# EAGLE design 5411507 (EAGLE 6.6.0)
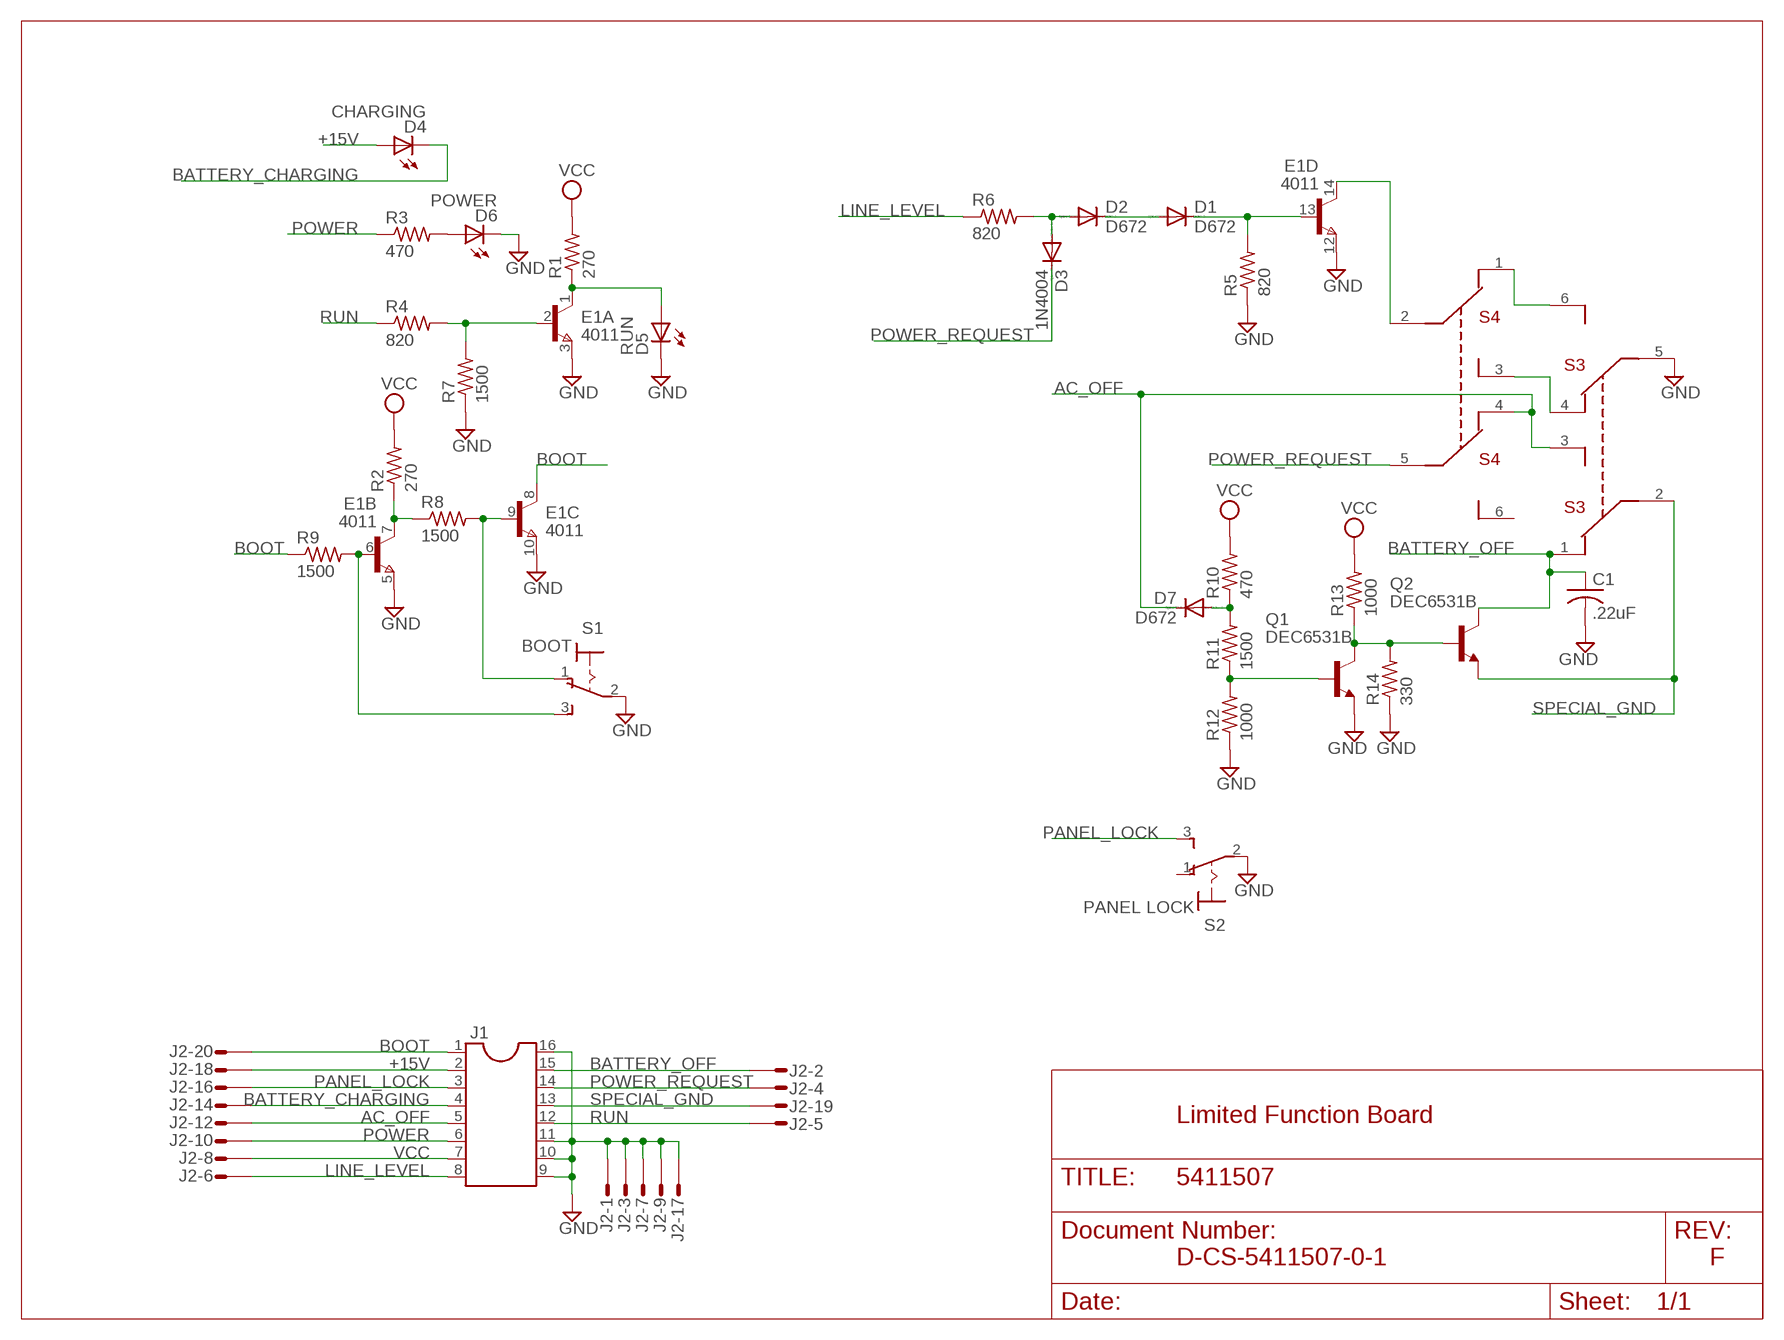
[diagram p0: schematic, sheet 1]

## Parts
C1  .22uF  C-US050-030X075  [C050-030X075]
D1  D672  DIODE-DO35-10  [DO35-10]
D2  D672  DIODE-DO35-10  [DO35-10]
D3  1N4004  [DO41-10]
D4  CHARGING  LED5MM  [LED5MM]
D5  RUN  LED5MM  [LED5MM]
D6  POWER  LED5MM  [LED5MM]
D7  D672  DIODE-DO35-10  [DO35-10]
E1  4011  MAT-04Y  [DIL14]
J1  DIL16S  [SOCKET-16]
J2  20HS  [20H]
Q1  DEC6531B  -NPN-TO5  [TO5]
Q2  DEC6531B  -NPN-TO5  [TO5]
R1  270  R-US_0207/10  [0207/10]
R2  270  R-US_0207/10  [0207/10]
R3  470  R-US_0207/10  [0207/10]
R4  820  R-US_0207/10  [0207/10]
R5  820  R-US_0207/10  [0207/10]
R6  820  R-US_0207/10  [0207/10]
R7  1500  R-US_0207/10  [0207/10]
R8  1500  R-US_0207/10  [0207/10]
R9  1500  R-US_0207/10  [0207/10]
R10  470  R-US_0207/10  [0207/10]
R11  1500  R-US_0207/10  [0207/10]
R12  1000  R-US_0207/10  [0207/10]
R13  1000  R-US_0207/10  [0207/10]
R14  330  R-US_0207/10  [0207/10]
S1  BOOT  710X  [7109MD9V3]
S2  PANEL LOCK  710X  [7109MD9V3]
S3  ON/OFF  720X  [7209MD9V3]
S4  M/S  720X  [7209MD9V3]

## Nets
+15V [supply]: D4.A J1.2 J2.18
AC_OFF: D7.C J1.5 J2.12 S3.3(A3) S4.4(B1)
BATTERY_CHARGING: D4.K(C) J1.4 J2.14
BATTERY_OFF: C1.1 J1.15 J2.2 Q2.3(C) S3.1(A1)
BOOT: E1.8(C:C) J1.1 J2.20 R9.1
GND [supply]: C1.2 D5.K(C) D6.K(C) E1.3(A:E) E1.5(B:E) E1.10(C:E) E1.12(D:E) J1.9 J1.10 J1.11 J1.16 J2.1 J2.3 J2.7 J2.9 J2.17 Q1.1(E) R5.1 R7.1 R12.1 R14.1 S1.2(P) S2.2(P) S3.5(B2)
LINE_LEVEL: J1.8 J2.6 R6.1
N$1: D6.A R3.2
N$2: Q1.3(C) Q2.2(B) R13.1 R14.2
N$3: D7.A R10.1 R11.2
N$4: Q1.2(B) R11.1 R12.2
N$5: D1.A D2.C
N$6: D1.C E1.13(D:B) R5.2
N$8: S3.4(B1) S4.3(A3)
N$9: S3.6(B3) S4.1(A1)
N$10: D2.A D3.A R6.2
N$11: E1.2(A:B) R4.2 R7.2
N$12: D5.A E1.1(A:C) R1.1
N$13: E1.7(B:C) R2.1 R8.1
N$14: E1.6(B:B) R9.2 S1.3(S)
N$15: E1.9(C:B) R8.2 S1.1(O)
N$16: E1.14(D:C) S4.2(A2)
PANEL_LOCK: J1.3 J2.16 S2.3(S)
POWER: J1.6 J2.10 R3.1
POWER_REQUEST: D3.C J1.14 J2.4 S4.5(B2)
RUN: J1.12 J2.5 R4.1
SPECIAL_GND: J1.13 J2.19 Q2.1(E) S3.2(A2)
VCC [supply]: J1.7 J2.8 R1.2 R2.2 R10.2 R13.2
Unconnected: J2.11 J2.13 J2.15 S2.1(O) S4.6(B3)

## Notes on the sheet
- Limited Function Board
- D-CS-5411507-0-1 | F

## Power pins joined to a net without a drawn wire
GND: S1.NC@1(GND) S1.NC@2(GND) S1.NC@3(GND) S1.NC@4(GND) S1.NC@5(GND) S1.NC@6(GND) S1.NC@7(GND) S1.NC@8(GND) S2.NC@1(GND) S2.NC@2(GND) S2.NC@3(GND) S2.NC@4(GND) S2.NC@5(GND) S2.NC@6(GND) S2.NC@7(GND) S2.NC@8(GND) S3.NC@1(GND) S3.NC@2(GND) S3.NC@3(GND) S3.NC@4(GND) S3.NC@5(GND) S3.NC@6(GND) S3.NC@7(GND) S3.NC@8(GND) S4.NC@1(GND) S4.NC@2(GND) S4.NC@3(GND) S4.NC@4(GND) S4.NC@5(GND) S4.NC@6(GND) S4.NC@7(GND) S4.NC@8(GND)

## Library data of the parts
C1 = rcl:C-US: CAPACITOR, American symbol
D1 D2 D7 = diode:DIODE-: DIODE
D3 = diode:1N4004: DIODE general purpose rectifier, 1 A
D4-D6 = led:LED: LED OSRAM: - CHIPLED LG R971, LG N971, LY N971, LG Q971, LY Q971, LO R971, LY R971 LH N974, LH R974 LS Q976, LO Q976, LY Q976 LO Q996 - Hyper CHIPLED LW Q18S LB Q993, LB Q99A, LB R99A - SideLED LS A670, LO A670, LY A670, LG A670, LP A670 LB A673, LV A673, LT A673, LW A673 LH A674 LY A675 LS A676, LA A676, LO A676, LY A676, LW A676 LS A679, LY A679, LG A679 - Hyper Micro SIDELED® LS Y876, LA Y876, LO Y876, LY Y876 LT Y87S - SmartLED LW L88C, LW L88S LB L89C, LB L89S, LG L890 LS L89K, LO L89K, LY L89K LS L896, LA L896, LO L896, LY L896 - TOPLED LS T670, LO T670, LY T670, LG T670, LP T670 LSG T670, LSP T670, LSY T670, LOP T670, LYG T670 LG T671, LOG T671, LSG T671 LB T673, LV T673, LT T673, LW T673 LH T674 LS T676, LA T676, LO T676, LY T676, LB T676, LH T676, LSB T676, LW T676 LB T67C, LV T67C, LT T67C, LS T67K, LO T67K, LY T67K, LW E67C LS E67B, LA E67B, LO E67B, LY E67B, LB E67C, LV E67C, LT E67C LW T67C LS T679, LY T679, LG T679 LS T770, LO T770, LY T770, LG T770, LP T770 LB T773, LV T773, LT T773, LW T773 LH T774 LS E675, LA E675, LY E675, LS T675 LS T776, LA T776, LO T776, LY T776, LB T776 LHGB T686 LT T68C, LB T68C - Hyper Mini TOPLED® LB M676 - Mini TOPLED Santana® LG M470 LS M47K, LO M47K, LY M47K Source: http://www.osram.convergy.de LUXEON: - LUMILED® LXK2-PW12-R00, LXK2-PW12-S00, LXK2-PW14-U00, LXK2-PW14-V00 LXK2-PM12-R00, LXK2-PM12-S00, LXK2-PM14-U00 LXK2-PE12-Q00, LXK2-PE12-R00, LXK2-PE12-S00, LXK2-PE14-T00, LXK2-PE14-U00 LXK2-PB12-K00, LXK2-PB12-L00, LXK2-PB12-M00, LXK2-PB14-N00, LXK2-PB14-P00, LXK2-PB14-Q00 LXK2-PR12-L00, LXK2-PR12-M00, LXK2-PR14-Q00, LXK2-PR14-R00 LXK2-PD12-Q00, LXK2-PD12-R00, LXK2-PD12-S00 LXK2-PH12-R00, LXK2-PH12-S00 LXK2-PL12-P00, LXK2-PL12-Q00, LXK2-PL12-R00 Source: www.luxeon.com KINGBRIGHT: KA-3528ASYC Source: www.kingbright.com
E1 = linear:MAT-04: Quad TRANSISTOR
J1 = ic-package:DIL16: Dual In Line / Socket
J2 = con-harting-h:20HS: CONNECTOR; OC_FARNELL: unknown; OC_NEWARK: unknown
Q1 Q2 = transistor:*-NPN-: NPN Transistror BF959 corrected 2008.03.06
R1-R14 = rcl:R-US_: RESISTOR, American symbol
S1 S2 = dec-con:710X: 710x with optional V2 or V3 mounting bracket.
S3 S4 = dec-con:720X: 720x Switch with mounting brackets.

## Net classes
0 default: width 0.813 mm
1 supply: width 0.813 mm

## Board
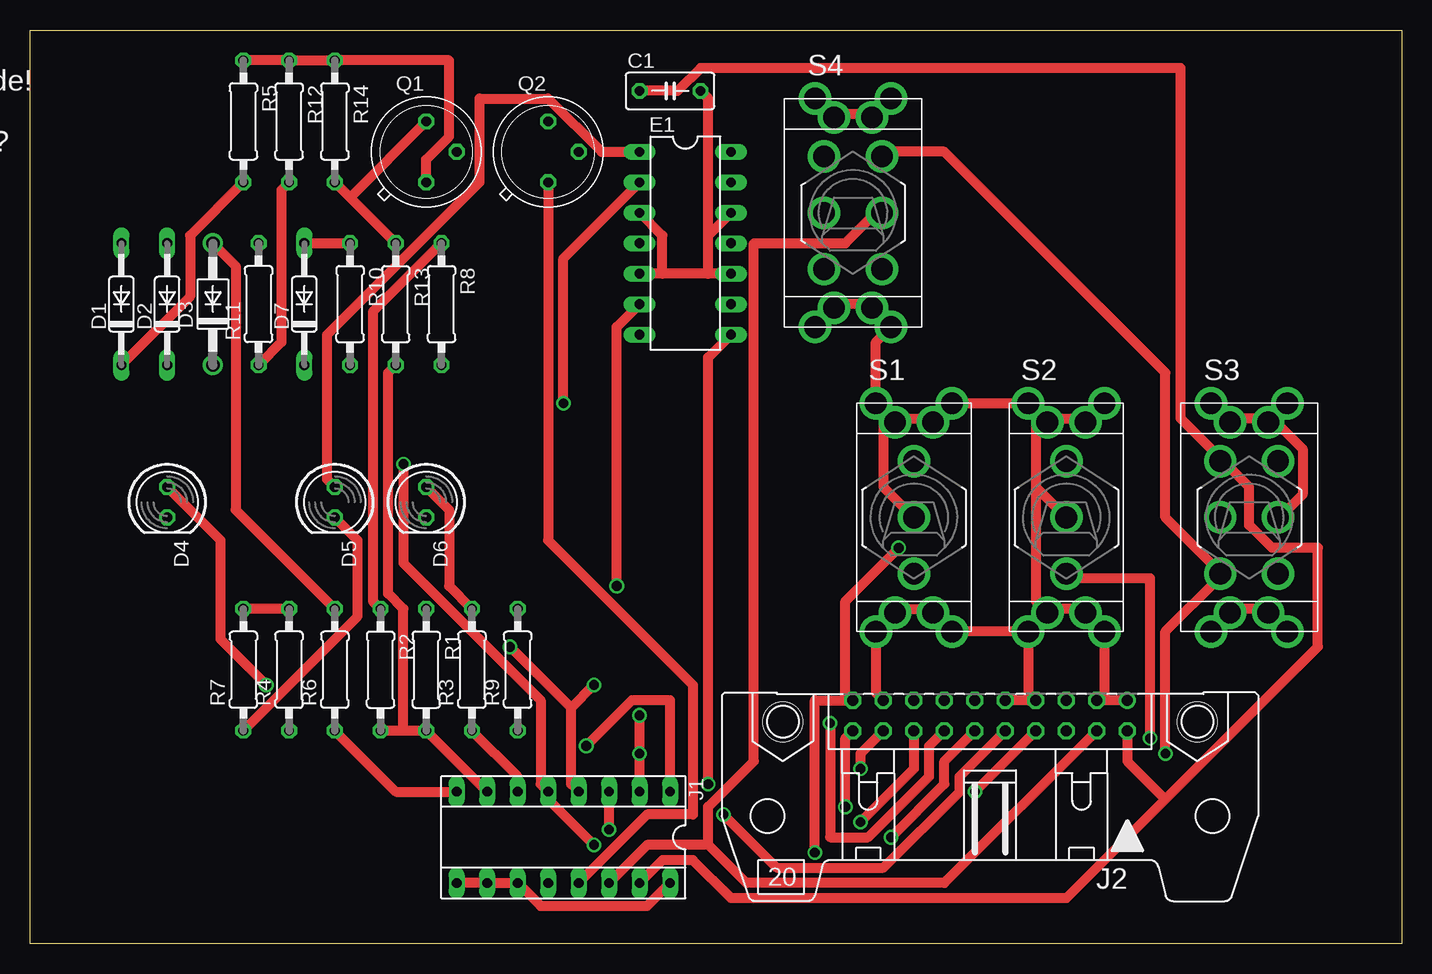
[diagram p1: board, top side]
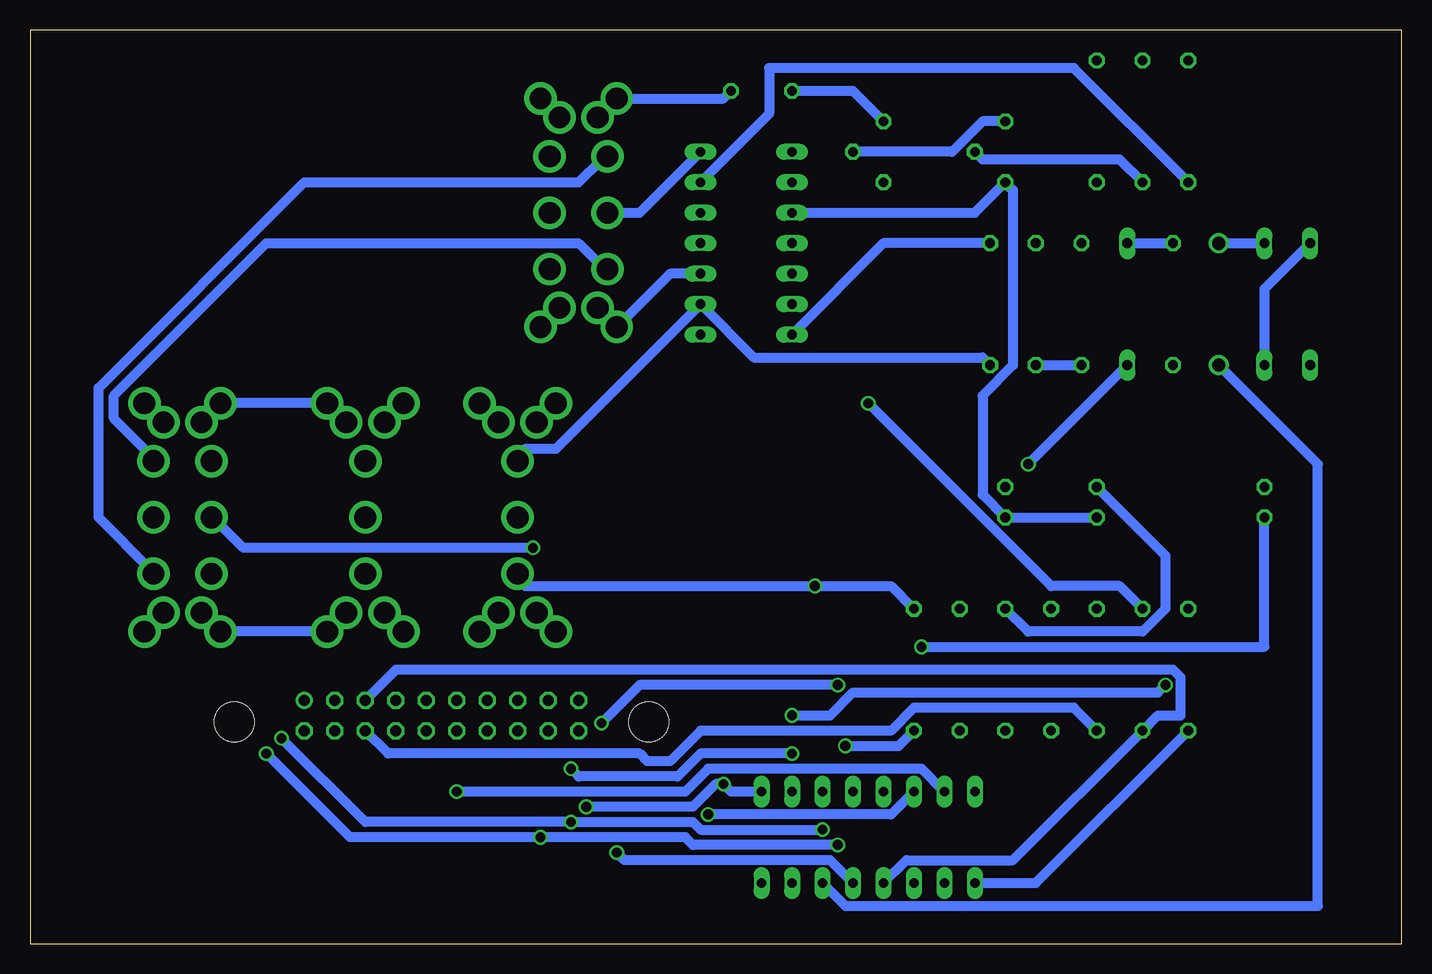
[diagram p2: board, bottom side, seen from below]

Size 114.3 x 76.2 mm. Coordinates in mm from the lower left corner, seen from the top.
Outline: 0,0 0,76.2 114.3,76.2 114.3,0 0,0
Copper layers (1+16): Top 0.035mm / dielectric 1.5mm / Bottom 0.035mm
Design rules "16mils": minimum track width 16mil, minimum drill 32mil, track to track 15mil, track to pad 10mil, pad to pad 10mil, via to via 10mil, smd to smd 10mil, copper to edge 13mil, drill to drill 10mil, minimum pad ring 10mil, minimum via ring 8mil, stop-mask expansion 0mil, vias tented up to drill 0mil, thermal gap 10mil

### Footprints (pad centres in the part's own frame; a part is rotated, then mirrored left to right if it is on the bottom)
C050-030X075 = drill 0.813 octagon: 1 -2.54,0; 2 2.54,0
DO35-10 = drill 0.813 long: A 5.08,0; C -5.08,0
DO41-10 = drill 1.118: A 5.08,0; C -5.08,0
LED5MM = drill 0.813 octagon: A -1.27,0; K 1.27,0
DIL14 = drill 0.813 long: 1 -7.62,-3.81; 2 -5.08,-3.81; 3 -2.54,-3.81; 4 0,-3.81; 5 2.54,-3.81; 6 5.08,-3.81; 7 7.62,-3.81; 8 7.62,3.81; 9 5.08,3.81; 10 2.54,3.81; 11 0,3.81; 12 -2.54,3.81; 13 -5.08,3.81; 14 -7.62,3.81
SOCKET-16 = drill 0.813 long: 1 -8.89,-3.81; 2 -6.35,-3.81; 3 -3.81,-3.81; 4 -1.27,-3.81; 5 1.27,-3.81; 6 3.81,-3.81; 7 6.35,-3.81; 8 8.89,-3.81; 9 8.89,3.81; 10 6.35,3.81; 11 3.81,3.81; 12 1.27,3.81; 13 -1.27,3.81; 14 -3.81,3.81; 15 -6.35,3.81; 16 -8.89,3.81
20H = drill 0.914: 1 -11.43,-1.27 | drill 0.914 octagon: 2 -11.43,1.27; 3 -8.89,-1.27; 4 -8.89,1.27; 5 -6.35,-1.27; 6 -6.35,1.27; 7 -3.81,-1.27; 8 -3.81,1.27; 9 -1.27,-1.27; 10 -1.27,1.27; 11 1.27,-1.27; 12 1.27,1.27; 13 3.81,-1.27; 14 3.81,1.27; 15 6.35,-1.27; 16 6.35,1.27; 17 8.89,-1.27; 18 8.89,1.27; 19 11.43,-1.27; 20 11.43,1.27 | hole 3.302: -17.272,0.533; 17.272,0.533
TO5 = drill 0.813 octagon: 1 0,-2.54; 2 2.54,0; 3 0,2.54
0207/10 = drill 0.813 octagon: 1 -5.08,0; 2 5.08,0
7109MD9V3 = drill 1.803: 1 0,4.699; 2 0,0; 3 0,-4.699; NC@1 -3.175,9.525; NC@2 -1.587,7.938; NC@3 3.175,9.525; NC@4 1.587,7.938; NC@5 -3.175,-9.525; NC@6 -1.587,-7.938; NC@7 1.587,-7.938; NC@8 3.175,-9.525
7209MD9V3 = drill 1.803: 1 -2.413,4.699; 2 -2.413,0; 3 -2.413,-4.699; 4 2.413,4.699; 5 2.413,0; 6 2.413,-4.699; NC@1 -3.175,9.525; NC@2 -1.587,7.938; NC@3 3.175,9.525; NC@4 1.587,7.938; NC@5 -3.175,-9.525; NC@6 -1.587,-7.938; NC@7 1.587,-7.938; NC@8 3.175,-9.525

### Placement (x,y rotation side)
C1  53.34,71.12 0 top
D1  7.62,53.34 90 top
D2  11.43,53.34 90 top
D3  15.24,53.34 90 top
D4  11.43,36.83 270 top
D5  25.4,36.83 270 top
D6  33.02,36.83 270 top
D7  22.86,53.34 90 top
E1  54.61,58.42 270 top
J1  44.45,8.89 180 top
J2  80.01,19.05 180 top
Q1  33.02,66.04 0 top
Q2  43.18,66.04 0 top
R1  33.02,22.86 270 top
R2  29.21,22.86 270 top
R3  36.83,22.86 90 top
R4  21.59,22.86 90 top
R5  17.78,68.58 270 top
R6  25.4,22.86 90 top
R7  17.78,22.86 90 top
R8  34.29,53.34 270 top
R9  40.64,22.86 90 top
R10  26.67,53.34 270 top
R11  19.05,53.34 90 top
R12  21.59,68.58 270 top
R13  30.48,53.34 270 top
R14  25.4,68.58 270 top
S1  73.66,35.56 0 top
S2  86.36,35.56 0 top
S3  101.6,35.56 0 top
S4  68.58,60.96 0 top

### Tracks (layer width: path | path; a pad name or v marks a point on that pad's centre or on a via)
+15V  (via drill 0.81)
  Top 0.813: D4.A 15.88,33.66 15.88,25.4 v19.68,21.59 | J1.2 v50.8,15.88 v50.8,19.05 | J2.18 69.22,15.88 v69.22,14.61
  Bottom 0.813: v19.68,21.59 20.32,20.95 45.72,20.95 47.62,19.05 v50.8,19.05 | v69.22,14.61 68.58,13.97 60.33,13.97 58.42,15.88 v50.8,15.88
AC_OFF  (via drill 0.81)
  Top 0.813: S4.4 71.12,66.04 76.2,66.04 94.61,47.62 94.61,35.56 99.06,31.11 S3.3 99.06,30.48 94.61,26.04 v94.61,15.88 | v31.11,40.01 31.11,31.75 42.55,20.32 42.55,13.34 J1.5 43.18,12.06 v46.99,8.26 | J2.12 76.2,15.24 76.2,13.34 v71.75,8.89
  Bottom 0.813: D7.C v31.11,40.01 | v46.99,8.26 59.05,8.26 59.69,8.89 v71.75,8.89 87.63,8.89 v94.61,15.88
BATTERY_CHARGING  (via drill 0.81)
  Top 0.813: 45.09,19.68 v40.01,24.77 | 45.09,19.68 45.09,13.34 J1.4 | J2.14 74.93,16.51 74.93,13.97 69.85,8.89 66.67,8.89 v66.67,18.41 | 45.09,19.68 v46.99,21.59
  Bottom 0.813: D4.K 11.43,24.77 v40.01,24.77 | v66.67,18.41 63.5,21.59 v46.99,21.59
BATTERY_OFF
  Top 0.813: J1.15 52.7,6.99 55.24,6.99 58.42,3.81 86.36,3.81 94.61,12.06 | J2.2 91.44,15.24 94.61,12.06 | 94.61,12.06 107.31,24.77 107.31,33.02 103.5,33.02 101.6,34.92 101.6,38.1 99.69,40.01 S3.1 99.06,40.64 95.89,43.81 95.89,73.03 55.88,73.03 53.98,71.12 C1.1
  Bottom 0.813: Q2.3 45.72,71.12 C1.1
BOOT  (via drill 0.81)
  Top 0.813: v46.35,16.51 50.16,20.32 53.34,20.32 J1.1 | E1.8 56.52,48.9 v56.52,13.34 | J2.20 67.94,17.14 v67.94,11.43
  Bottom 0.813: R9.1 41.91,16.51 v46.35,16.51 | J1.1 55.88,12.7 v56.52,13.34 57.15,13.34 59.05,11.43 v67.94,11.43
GND
  Top 0.813: J2.17 70.48,20.95 S1.NC@5 S1.NC@6 72.39,27.94 74.93,27.94 S1.NC@7 S1.NC@8 S2.NC@5 | S3.NC@5 S3.NC@6 100.33,27.94 102.87,27.94 S3.NC@7 S3.NC@8 | 83.19,20.32 J2.9 | S2.NC@5 83.19,20.32 | 83.19,20.32 J2.7 | S2.NC@5 S2.NC@6 | J2.1 89.53,20.32 | 89.53,20.32 S2.NC@8 S2.NC@7 87.63,27.94 85.09,27.94 S2.NC@6 | 89.53,20.32 J2.3 | S3.NC@1 S3.NC@2 100.33,43.81 102.87,43.81 S3.NC@4 103.5,43.81 | S3.NC@3 103.5,43.81 | 103.5,43.81 106.05,41.27 106.05,37.47 104.14,35.56 S3.5 | S2.NC@3 S2.NC@4 87.63,43.81 85.09,43.81 S2.NC@2 | 83.82,44.45 S2.NC@1 S1.NC@3 S1.NC@4 74.93,43.81 72.39,43.81 S1.NC@2 71.12,44.45 | 83.82,44.45 S2.NC@2 | 83.82,38.1 S2.2 | 83.82,44.45 83.82,38.1 | 84.45,43.81 S2.NC@2 | S4.NC@5 S4.NC@6 67.31,53.34 69.85,53.34 S4.NC@7 S4.NC@8 70.48,50.16 S1.NC@1 71.12,44.45 | S1.2 71.12,38.1 71.12,44.45 | S2.NC@6 83.82,28.57 83.82,38.1 | J1.9 J1.10 J1.11 42.55,3.17 51.44,3.17 J1.16 | D5.K 27.3,33.66 27.3,27.3 R7.1 | S4.NC@3 S4.NC@4 69.85,69.22 67.31,69.22 S4.NC@2 S4.NC@1 | R5.1 R12.1 R14.1 34.92,73.66 34.92,67.31 33.02,65.41 Q1.1 | E1.10 56.52,55.88 | 56.52,55.88 52.7,55.88 | 52.7,55.88 E1.5 | E1.3 52.7,59.05 52.7,55.88 | 56.52,59.05 E1.12 | 56.52,55.88 56.52,59.05 | C1.2 56.52,70.48 56.52,59.05
  Bottom 0.813: S2.NC@8 S3.NC@5 | S2.NC@3 S3.NC@1 | D5.K D6.K 34.92,37.47 34.92,45.72 32.38,48.26 32.38,62.87 Q1.1 35.56,60.96 E1.3 | R7.1 30.48,5.08 J1.9 | C1.2 56.52,70.48 S4.NC@1 | S4.NC@5 60.96,55.88 E1.10
LINE_LEVEL
  Top 0.813: J1.8 30.48,12.7 R6.1
  Bottom 0.813: J2.6 84.45,15.88 63.5,15.88 62.87,15.24 60.96,15.24 58.42,17.78 42.55,17.78 40.64,19.68 27.3,19.68 R6.1
N$1
  Top 0.813: R3.2 34.92,29.84 34.92,36.2 D6.A
N$2
  Top 0.813: R14.2 26.67,62.23 | 26.67,62.23 R13.1 | Q1.3 26.67,62.23
  Bottom 0.813: Q2.2 37.47,66.04 34.92,68.58 Q1.3
N$3
  Top 0.813: D7.A R10.1
  Bottom 0.813: D7.A R11.2
N$4
  Top 0.813: R11.1 20.95,50.16 20.95,62.87 R12.2
  Bottom 0.813: Q1.2 34.92,65.41 23.5,65.41 R12.2
N$5
  Bottom 0.813: D2.C 11.43,54.61 D1.A
N$6
  Top 0.813: D1.C 13.34,53.98 13.34,59.05 R5.2
  Bottom 0.813: E1.13 52.7,69.22 52.7,73.03 27.3,73.03 R5.2
N$8
  Bottom 0.813: S4.3 66.67,56.52 68.58,58.42 94.61,58.42 107.31,45.72 107.31,43.81 104.14,40.64 S3.4
N$9
  Bottom 0.813: S4.1 66.67,65.41 68.58,63.5 91.44,63.5 108.58,46.35 108.58,35.56 104.14,31.11 S3.6
N$10
  Top 0.813: R6.2 17.14,36.2 17.14,56.52 D3.A
  Bottom 0.813: D3.A D2.A
N$11  (via drill 0.81)
  Top 0.813: R4.2 R7.2 | E1.2 44.45,57.15 v44.45,45.09
  Bottom 0.813: v44.45,45.09 29.21,29.84 23.5,29.84 R4.2
N$12
  Top 0.813: E1.1 47.62,66.04 43.18,70.48 37.47,70.48 37.47,63.5 24.77,50.8 24.77,38.73 D5.A
  Bottom 0.813: R1.1 31.11,26.04 21.59,26.04 19.68,27.94 19.68,32.38 D5.A
N$13
  Top 0.813: R2.1 28.57,28.57 28.57,52.7 R8.1
  Bottom 0.813: E1.7 43.18,58.42 R8.1
N$14  (via drill 0.81)
  Top 0.813: E1.6 48.9,51.44 v48.9,29.84
  Bottom 0.813: R9.2 42.55,29.84 v48.9,29.84 73.03,29.84 73.66,30.48 S1.3
N$15
  Bottom 0.813: R8.2 34.92,48.9 53.98,48.9 E1.9 70.48,41.27 73.03,41.27 73.66,40.64 S1.1
N$16
  Bottom 0.813: E1.14 63.5,60.96 S4.2
PANEL_LOCK  (via drill 0.81)
  Top 0.813: v48.26,9.53 J1.3 | v69.22,10.16 73.66,14.61 J2.16 | v93.34,17.14 93.34,30.48 86.36,30.48 S2.3
  Bottom 0.813: v48.26,9.53 58.42,9.53 59.05,10.16 v69.22,10.16 86.36,10.16 v93.34,17.14
POWER  (via drill 0.81)
  Top 0.813: R3.1 40.64,13.97 J1.6 | J2.10 77.47,13.97 77.47,12.7 71.12,6.35 62.23,6.35 v57.78,10.79
  Bottom 0.813: v57.78,10.79 42.55,10.79 J1.6
POWER_REQUEST
  Top 0.813: J1.14 51.44,8.26 56.52,8.26 | 56.52,8.26 59.69,5.08 76.2,5.08 J2.4 | 56.52,8.26 56.52,11.43 60.33,15.24 60.33,58.42 67.94,58.42 70.48,60.96 S4.5
  Bottom 0.813: D3.C 6.99,40.01 6.99,3.17 46.35,3.17 J1.14
RUN
  Bottom 0.813: J1.12 41.27,6.99 32.38,6.99 R4.1 20.32,19.05 18.41,19.05 18.41,22.23 19.05,22.86 83.82,22.86 J2.5
SPECIAL_GND  (via drill 0.81)
  Top 0.813: J1.13 51.44,10.79 55.24,10.79 55.24,21.59 43.18,33.66 Q2.1 | 67.94,20.32 65.41,20.32 v65.41,7.62 | v72.39,33.02 67.94,28.57 67.94,20.32 | 67.94,20.32 J2.19
  Bottom 0.813: v65.41,7.62 64.77,6.99 47.62,6.99 J1.13 | v72.39,33.02 96.52,33.02 99.06,35.56 S3.2
VCC  (via drill 0.81)
  Top 0.813: 31.11,17.78 R1.2 J1.7 | 31.11,17.78 R2.2 | v78.74,12.7 J2.8 | R13.2 29.84,47.62 29.84,29.21 31.11,27.94 31.11,17.78
  Bottom 0.813: R13.2 R10.2 | v78.74,12.7 59.69,12.7 57.78,14.61 40.01,14.61 J1.7

### Text on the board
tPlace: J2 is not drawn on the solder side! | Non-DEC layout. | Mounting holes and clearances?